# EAGLE design uC (EAGLE 8.2.1)
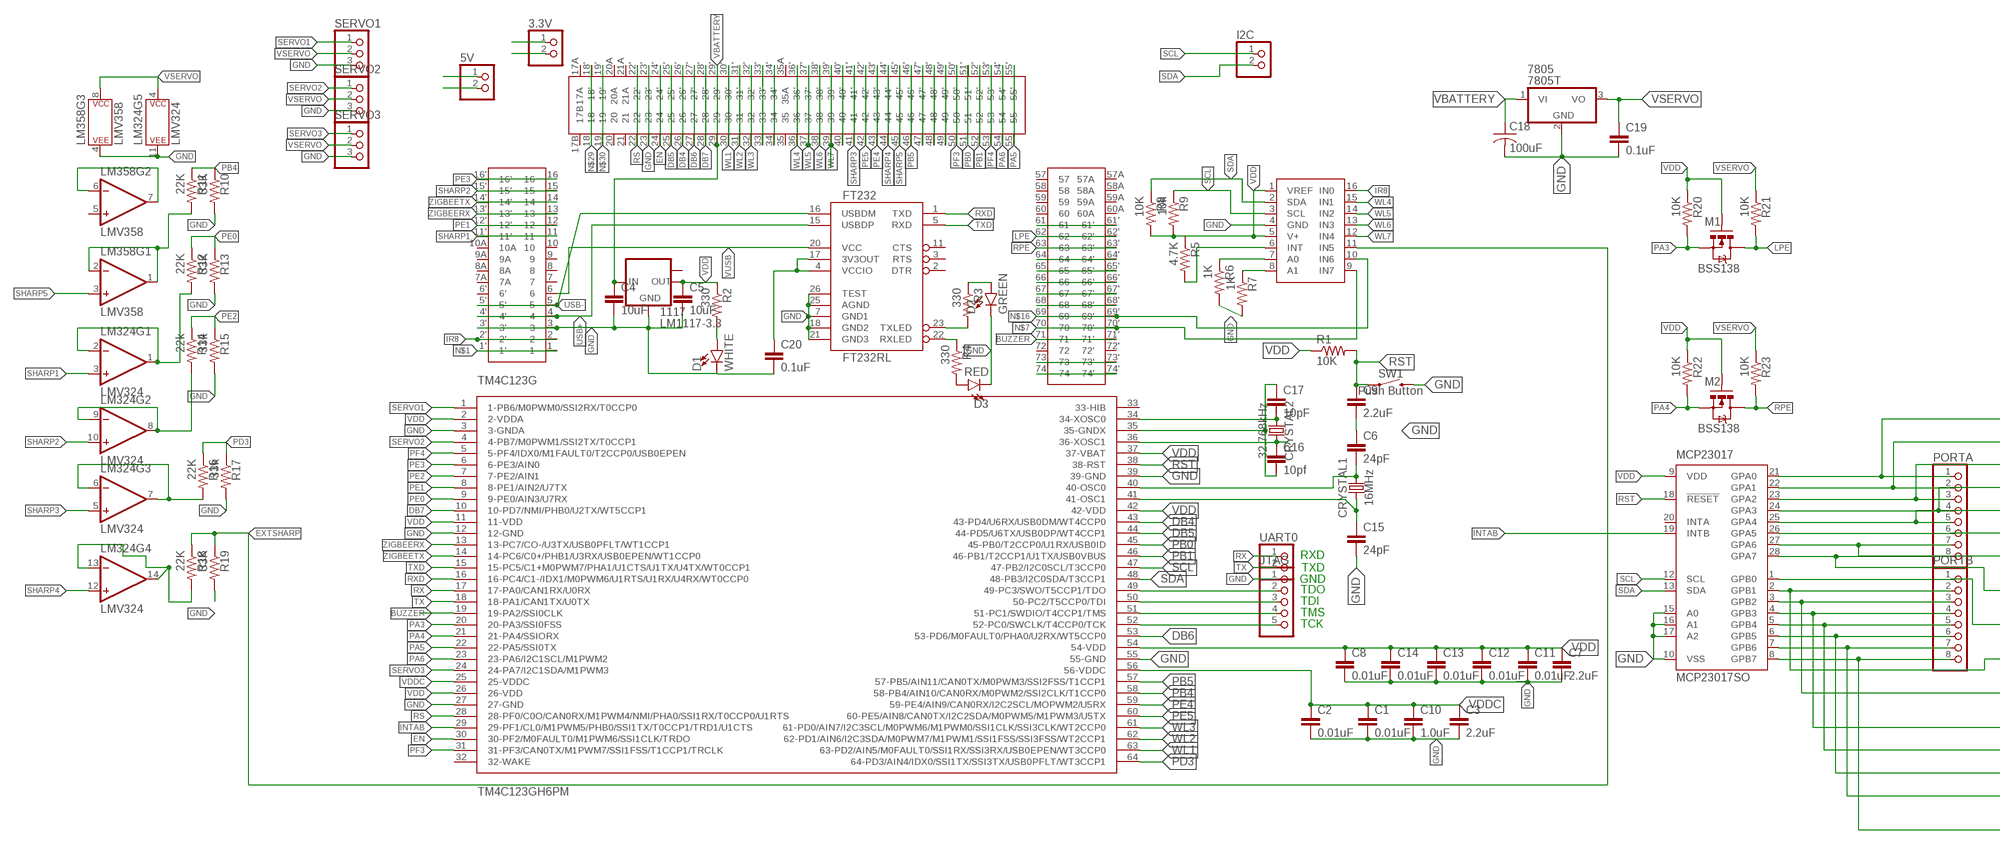
[diagram p0: schematic, sheet 1, part 1 of 2]
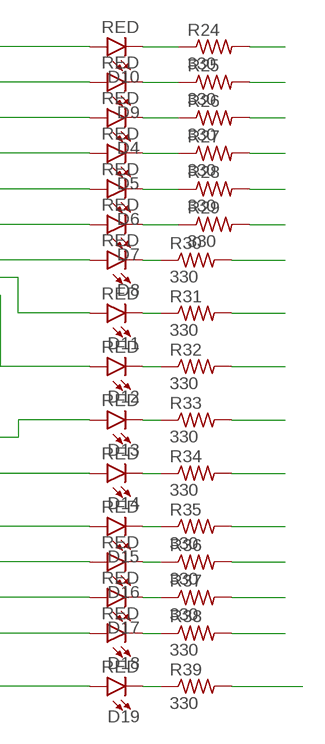
[diagram p1: schematic, sheet 1, part 2 of 2]

## Parts
3.3V  PINHD-1X2  [1X02]
5V  PINHD-1X2  [1X02]
1117  LM1117-3.3  LM1117IMPX-3.3  [SOT223]
7805  7805T  [TO220H]
ADC128D818  ADC128D818  [ADC12_SD]
C1  0.01uF  2.2UF-CERCAP-10009  [1206]
C2  0.01uF  2.2UF-CERCAP-10009  [1206]
C3  2.2uF  2.2UF-1206-50V-10%  [1206]
C4  10uF  10UF-1206-6.3V-20%  [1206]
C5  10uF  10UF-1206-6.3V-20%  [1206]
C6  24pF  2.2UF-CERCAP-10009  [1206]
C7  2.2uF  2.2UF-CERCAP-10009  [1206]
C8  0.01uF  2.2UF-CERCAP-10009  [1206]
C9  2.2uF  2.2UF-1206-50V-10%  [1206]
C10  1.0uF  1.0UF-1206-50V-10%  [1206]
C11  0.01uF  2.2UF-CERCAP-10009  [1206]
C12  0.01uF  2.2UF-CERCAP-10009  [1206]
C13  0.01uF  2.2UF-CERCAP-10009  [1206]
C14  0.01uF  2.2UF-CERCAP-10009  [1206]
C15  24pF  2.2UF-CERCAP-10009  [1206]
C16  10pf  2.2UF-CERCAP-10009  [1206]
C17  10pF  2.2UF-CERCAP-10009  [1206]
C18  100uF  C-US025-024X044  [C025-024X044]
C19  0.1uF  2.2UF-CERCAP-10009  [1206]
C20  0.1uF  10UF-1206-6.3V-20%  [1206]
CRYSTAL1  16MHz  CRYSTAL-16MHZPTH-HC49US  [HC49US]
CRYSTAL2  32.768kHz  CRYSTAL-32.768KHZPTH-2X6  [CRYSTAL-PTH-2X6-CYL]
D1  WHITE  LED-WHITE1206  [LED-1206]
D2  GREEN  LED-WHITE1206  [LED-1206]
D3  RED  LED-WHITE1206  [LED-1206]
D4  RED  LED-WHITE1206  [LED-1206]
D5  RED  LED-WHITE1206  [LED-1206]
D6  RED  LED-WHITE1206  [LED-1206]
D7  RED  LED-WHITE1206  [LED-1206]
D8  RED  LED-WHITE1206  [LED-1206]
D9  RED  LED-WHITE1206  [LED-1206]
D10  RED  LED-WHITE1206  [LED-1206]
D11  RED  LED-WHITE1206  [LED-1206]
D12  RED  LED-WHITE1206  [LED-1206]
D13  RED  LED-WHITE1206  [LED-1206]
D14  RED  LED-WHITE1206  [LED-1206]
D15  RED  LED-WHITE1206  [LED-1206]
D16  RED  LED-WHITE1206  [LED-1206]
D17  RED  LED-WHITE1206  [LED-1206]
D18  RED  LED-WHITE1206  [LED-1206]
D19  RED  LED-WHITE1206  [LED-1206]
FT232  FT232RL  FT232RL-BASICSSOP  [SSOP28DB]
I2C  PINHD-1X2  [1X02]
JTAG  PINHD-1X5_2.54  [1X05]
LM324  LMV324  [SO14]
LM358  LMV358  LMV358SOIC  [SO08]
M1  BSS138  MOSFET-NCHANNELSMD  [SOT23-3]
M2  BSS138  MOSFET-NCHANNELSMD  [SOT23-3]
MCP23017  MCP23017SO  [SO28W]
PORTA  PINHD-1X8BIG  [1X08-BIG]
PORTB  PINHD-1X8BIG  [1X08-BIG]
R1  10K  R-US_M1206  [M1206]
R2  330  R-US_M1206  [M1206]
R3  330  R-US_M1206  [M1206]
R4  330  R-US_M1206  [M1206]
R5  4.7K  R-US_M1206  [M1206]
R6  1K  R-US_M1206  [M1206]
R7  1K  R-US_M1206  [M1206]
R8  10K  R-US_M1206  [M1206]
R9  10k  R-US_M1206  [M1206]
R10  33K  R-US_M1206  [M1206]
R11  22K  R-US_M1206  [M1206]
R12  22K  R-US_M1206  [M1206]
R13  33K  R-US_M1206  [M1206]
R14  22k  R-US_M1206  [M1206]
R15  33k  R-US_M1206  [M1206]
R16  22K  R-US_M1206  [M1206]
R17  33k  R-US_M1206  [M1206]
R18  22K  R-US_M1206  [M1206]
R19  33K  R-US_M1206  [M1206]
R20  10K  RESISTOR1206  [1206]
R21  10K  RESISTOR1206  [1206]
R22  10K  RESISTOR1206  [1206]
R23  10K  RESISTOR1206  [1206]
R24  330  R-US_M1206  [M1206]
R25  330  R-US_M1206  [M1206]
R26  330  R-US_M1206  [M1206]
R27  330  R-US_M1206  [M1206]
R28  330  R-US_M1206  [M1206]
R29  330  R-US_M1206  [M1206]
R30  330  R-US_M1206  [M1206]
R31  330  R-US_M1206  [M1206]
R32  330  R-US_M1206  [M1206]
R33  330  R-US_M1206  [M1206]
R34  330  R-US_M1206  [M1206]
R35  330  R-US_M1206  [M1206]
R36  330  R-US_M1206  [M1206]
R37  330  R-US_M1206  [M1206]
R38  330  R-US_M1206  [M1206]
R39  330  R-US_M1206  [M1206]
SERVO1  PINHD-1X3  [1X03]
SERVO2  PINHD-1X3  [1X03]
SERVO3  PINHD-1X3  [1X03]
SW1  Push Button  MOMENTARY-SWITCH-SPST-PTH-6.0MM  [TACTILE_SWITCH_PTH_6.0MM]
TM4C123G  TM4C123GH6PM  TM4C123GH6PMS-PQFP-G64  [LQFP]
U$1  DAUGHTERBOARDDAUGHTERBOARD  [DAUGHTERBOARD]
UART0  PINHD-1X2  [1X02]

## Nets
BUZZER: TM4C123G.19(19-PA2/SSI0CLK) U$1.71 U$1.71'
DB4: TM4C123G.43(43-PD4/U6RX/USB0DM/WT4CCP0) U$1.26 U$1.26'
DB5: TM4C123G.44(44-PD5/U6TX/USB0DP/WT4CCP1) U$1.25 U$1.25'
DB6: TM4C123G.53(53-PD6/M0FAULT0/PHA0/U2RX/WT5CCP0) U$1.27 U$1.27'
DB7: TM4C123G.10(10-PD7/NMI/PHB0/U2TX/WT5CCP1) U$1.28 U$1.28'
EN: TM4C123G.30(30-PF2/M0FAULT0/M1PWM6/SSI1CLK/TRDO) U$1.24 U$1.24'
EXTSHARP: ADC128D818.11(IN5) R18.1 R19.1
FDSFSDF: LM324.1(OUT) LM324.2(-IN) R12.2
GND [VSERVO]: 3.3V.2 5V.2 1117.1(GND) 7805.2(GND) ADC128D818.4(GND) C1.2 C2.2 C3.2 C4.2 C5.2 C6.1 C7.2 C8.2 C9.2 C10.2 C11.2 C12.2 C13.2 C14.2 C15.2 C18.2 C19.2 C20.2 D1.C D2.C D3.C FT232.7(GND1) FT232.18(GND2) FT232.21(GND3) FT232.25(AGND) FT232.26(TEST) JTAG.1 LM324.11(P$V-) LM358.4(P$V-) MCP23017.10(VSS) MCP23017.15(A0) MCP23017.16(A1) MCP23017.17(A2) R6.2 R7.2 R10.2 R13.2 R15.2 R17.2 R19.2 R24.2 R25.2 R26.2 R27.2 R28.2 R29.2 R30.2 R31.2 R32.2 R33.2 R34.2 R35.2 R36.2 R37.2 R38.2 R39.2 SERVO1.3 SERVO2.3 SERVO3.3 SW1.3 TM4C123G.3(3-GNDA) TM4C123G.12(12-GND) TM4C123G.27(27-GND) TM4C123G.39(39-GND) TM4C123G.55(55-GND) U$1.3 U$1.3' U$1.23 U$1.23'
GNDX: C16.2 C17.1 TM4C123G.35(35-GNDX)
HGHJ: LM358.1(OUT) LM358.2(-IN) R11.2
INTAB: MCP23017.19(INTB) TM4C123G.29(29-PF1/CL0/M1PWM5/PHB0/SSI1TX/T0CCP1/TRD1/U1CTS)
IR8: ADC128D818.16(IN0) U$1.2 U$1.2'
LPE: M1.3(D) R21.2 U$1.62 U$1.62'
N$1: U$1.1 U$1.1'
N$2: D10.A MCP23017.21(GPA0) PORTA.1
N$3: C6.2 CRYSTAL1.2 TM4C123G.40(40-OSC0)
N$5: D9.A MCP23017.22(GPA1) PORTA.2
N$6: LM358.6(-IN) LM358.7(OUT)
N$7: ADC128D818.9(IN7) U$1.70 U$1.70'
N$8: D4.A MCP23017.23(GPA2) PORTA.3
N$9: D5.A MCP23017.24(GPA3) PORTA.4
N$10: D6.A MCP23017.25(GPA4) PORTA.5
N$11: JTAG.5 TM4C123G.52(52-PC0/SWCLK/T4CCP0/TCK)
N$12: U$1.74 U$1.74'
N$13: U$1.73 U$1.73'
N$14: LM324.13(-IN) LM324.14(OUT) R18.2
N$15: JTAG.4 TM4C123G.51(51-PC1/SWDIO/T4CCP1/TMS)
N$16: ADC128D818.10(IN6) D10.C R24.1 U$1.69 U$1.69'
N$17: U$1.68 U$1.68'
N$18: U$1.67 U$1.67'
N$19: U$1.66 U$1.66'
N$20: U$1.65 U$1.65'
N$21: U$1.64 U$1.64'
N$22: ADC128D818.7(A0) R6.1
N$23: D7.A MCP23017.26(GPA5) PORTA.6
N$24: U$1.61 U$1.61'
N$25: JTAG.3 TM4C123G.50(50-PC2/T5CCP0/TDI)
N$26: D1.A R2.2
N$27: C17.2 CRYSTAL2.1 TM4C123G.34(34-XOSC0)
N$28: C16.1 CRYSTAL2.2 TM4C123G.36(36-XOSC1)
N$29: D9.C R25.1 U$1.18 U$1.18'
N$30: D4.C R26.1 U$1.19 U$1.19'
N$31: JTAG.2 TM4C123G.49(49-PC3/SWO/T5CCP1/TDO)
N$32: D8.A MCP23017.27(GPA6) PORTA.7
N$33: D11.A MCP23017.28(GPA7) PORTA.8
N$34: D12.A MCP23017.1(GPB0) PORTB.1
N$35: D13.A MCP23017.2(GPB1) PORTB.2
N$36: D14.A MCP23017.3(GPB2) PORTB.3
N$37: D15.A MCP23017.4(GPB3) PORTB.4
N$38: D16.A MCP23017.5(GPB4) PORTB.5
N$39: D17.A MCP23017.6(GPB5) PORTB.6
N$40: D18.A MCP23017.7(GPB6) PORTB.7
N$41: D19.A MCP23017.8(GPB7) PORTB.8
N$42: U$1.33 U$1.33'
N$43: U$1.34 U$1.34'
N$44: D5.C R27.1
N$45: D6.C R28.1
N$46: D7.C R29.1
N$47: D8.C R30.1
N$48: U$1.40 U$1.40'
N$49: D11.C R31.1
N$50: D12.C R32.1
N$51: D13.C R33.1
N$52: D19.C R39.1
N$53: D18.C R38.1
N$54: D17.C R37.1
N$55: U$1.47 U$1.47'
N$56: U$1.48 U$1.48'
N$57: U$1.49 U$1.49'
N$58: D16.C R36.1
N$59: D15.C R35.1
N$60: D14.C R34.1
N$67: FT232.22(RXLED) R4.1
N$68: FT232.23(TXLED) R3.2
N$69: D3.A R4.2
N$70: D2.A R3.1
N$71: ADC128D818.6(INT) R5.2
N$73: ADC128D818.8(A1) R7.1
N$77: C20.1 FT232.4(VCCIO) FT232.17(3V3OUT)
NO: C15.1 CRYSTAL1.1 TM4C123G.41(41-OSC1)
PA3: M1.2(S) R20.2 TM4C123G.20(20-PA3/SSI0FSS)
PA4: M2.2(S) R22.2 TM4C123G.21(21-PA4/SSIORX)
PA5: TM4C123G.22(22-PA5/SSI0TX) U$1.55 U$1.55'
PA6: TM4C123G.23(23-PA6/I2C1SCL/M1PWM2) U$1.54 U$1.54'
PB0: TM4C123G.45(45-PB0/T2CCP0/U1RX/USB0ID) U$1.51 U$1.51'
PB1: TM4C123G.46(46-PB1/T2CCP1/U1TX/USB0VBUS) U$1.52 U$1.52'
PB4: R10.1 R11.1 TM4C123G.58(58-PB4/AIN10/CAN0RX/M0PWM2/SSI2CLK/T1CCP0)
PB5: TM4C123G.57(57-PB5/AIN11/CAN0TX/M0PWM3/SSI2FSS/T1CCP1) U$1.46 U$1.46'
PD3: R16.1 R17.1 TM4C123G.64(64-PD3/AIN4/IDX0/SSI1TX/SSI3TX/USB0PFLT/WT3CCP1)
PE0: R12.1 R13.1 TM4C123G.9(9-PE0/AIN3/U7RX)
PE1: TM4C123G.8(8-PE1/AIN2/U7TX) U$1.12 U$1.12'
PE2: R14.1 R15.1 TM4C123G.7(7-PE2/AIN1)
PE3: TM4C123G.6(6-PE3/AIN0) U$1.16 U$1.16'
PE4: TM4C123G.59(59-PE4/AIN9/CAN0RX/I2C2SCL/MOPWM2/U5RX) U$1.43 U$1.43'
PE5: TM4C123G.60(60-PE5/AIN8/CAN0TX/I2C2SDA/M0PWM5/M1PWM3/U5TX) U$1.42 U$1.42'
PF3: TM4C123G.31(31-PF3/CAN0TX/M1PWM7/SSI1FSS/T1CCP1/TRCLK) U$1.50 U$1.50'
PF4: TM4C123G.5(5-PF4/IDX0/M1FAULT0/T2CCP0/USB0EPEN) U$1.53 U$1.53'
RPE: M2.3(D) R23.2 U$1.63 U$1.63'
RS: TM4C123G.28(28-PF0/C0O/CAN0RX/M1PWM4/NMI/PHA0/SSI1RX/T0CCP0/U1RTS) U$1.22 U$1.22'
RST: C9.1 MCP23017.18(!RESET) R1.2 SW1.1 TM4C123G.38(38-RST)
RX: TM4C123G.17(17-PA0/CAN1RX/U0RX) UART0.1
RXD: FT232.1(TXD) TM4C123G.16(16-PC4/C1-/IDX1/M0PWM6/U1RTS/U1RX/U4RX/WT0CCP0)
SCL: ADC128D818.3(SCL) I2C.1 MCP23017.12(SCL) R9.1 TM4C123G.47(47-PB2/I2C0SCL/T3CCP0)
SDA: ADC128D818.2(SDA) I2C.2 MCP23017.13(SDA) R8.1 TM4C123G.48(48-PB3/I2C0SDA/T3CCP1)
SDFSDFSD: LM324.8(OUT) LM324.9(-IN) R14.2
SERVO1: SERVO1.1 TM4C123G.1(1-PB6/M0PWM0/SSI2RX/T0CCP0)
SERVO2: SERVO2.1 TM4C123G.4(4-PB7/M0PWM1/SSI2TX/T0CCP1)
SERVO3: SERVO3.1 TM4C123G.24(24-PA7/I2C1SDA/M1PWM3)
SHARP1: LM324.3(+IN) U$1.11 U$1.11'
SHARP2: LM324.10(+IN) U$1.15 U$1.15'
SHARP3: LM324.5(+IN) U$1.41 U$1.41'
SHARP4: LM324.12(+IN) U$1.44 U$1.44'
SHARP5: LM358.3(+IN) U$1.45 U$1.45'
TX: TM4C123G.18(18-PA1/CAN1TX/U0TX) UART0.2
TXD: FT232.5(RXD) TM4C123G.15(15-PC5/C1+M0PWM7/PHA1/U1CTS/U1TX/U4TX/WT0CCP1)
USB+: FT232.15(USBDP) U$1.4 U$1.4'
USB-: FT232.16(USBDM) U$1.5 U$1.5'
VBATTERY [VSERVO]: 1117.3(IN) 7805.1(VI) C4.1 C18.1 U$1.29 U$1.29'
VDD [VDD]: 3.3V.1 1117.2(OUT) ADC128D818.1(VREF) ADC128D818.5(V+) C5.1 C7.1 C8.1 C11.1 C12.1 C13.1 C14.1 M1.1(G) M2.1(G) MCP23017.9(VDD) R1.1 R2.1 R5.1 R8.2 R9.2 R20.1 R22.1 TM4C123G.2(2-VDDA) TM4C123G.11(11-VDD) TM4C123G.26(26-VDD) TM4C123G.37(37-VBAT) TM4C123G.42(42-VDD) TM4C123G.54(54-VDD)
VDDC: C1.1 C2.1 C3.1 C10.1 TM4C123G.25(25-VDDC) TM4C123G.56(56-VDDC)
VSERVO [VSERVO]: 5V.1 7805.3(VO) C19.1 LM324.4(P$V+) LM358.8(P$V+) R21.1 R23.1 SERVO1.2 SERVO2.2 SERVO3.2
VUSB: FT232.20(VCC) U$1.6
WL1: TM4C123G.63(63-PD2/AIN5/M0FAULT0/SSI1RX/SSI3RX/USB0EPEN/WT3CCP0) U$1.30 U$1.30'
WL2: TM4C123G.62(62-PD1/AIN6/I2C3SDA/M0PWM7/M1PWM1/SSI1FSS/SSI3FSS/WT2CCP1) U$1.31 U$1.31'
WL3: TM4C123G.61(61-PD0/AIN7/I2C3SCL/M0PWM6/M1PWM0/SSI1CLK/SSI3CLK/WT2CCP0) U$1.32 U$1.32'
WL4: ADC128D818.15(IN1) U$1.36 U$1.36'
WL5: ADC128D818.14(IN2) U$1.37 U$1.37'
WL6: ADC128D818.13(IN3) U$1.38 U$1.38'
WL7: ADC128D818.12(IN4) U$1.39 U$1.39'
XXVX: LM324.6(-IN) LM324.7(OUT) R16.2
ZIGBEERX: TM4C123G.13(13-PC7/CO-/U3TX/USB0PFLT/WT1CCP1) U$1.13 U$1.13'
ZIGBEETX: TM4C123G.14(14-PC6/C0+/PHB1/U3RX/USB0EPEN/WT1CCP0) U$1.14 U$1.14'
Unconnected: 1117.TAB(OUT1) FT232.2(DTR) FT232.3(RTS) FT232.11(CTS) LM358.5(+IN) MCP23017.20(INTA) TM4C123G.32(32-WAKE) TM4C123G.33(33-HIB) U$1.6' U$1.7 U$1.7A U$1.8 U$1.8A U$1.9 U$1.9A U$1.10 U$1.10A U$1.17A U$1.17B U$1.20 U$1.20A U$1.21 U$1.21A U$1.35 U$1.35A U$1.57 U$1.57A U$1.58 U$1.58A U$1.59 U$1.59A U$1.60 U$1.60A U$1.72 U$1.72'

## Notes on the sheet
- RXD
- TXD
- GND
- TDO
- TDI
- TMS
- TCK

## Library data of the parts
3.3V 5V I2C UART0 = pinhead:PINHD-1X2: PIN HEADER
1117 = lm1117:LM1117IMPX-*
7805 = adafruit:78*: Positive VOLTAGE REGULATOR Added bigger pads to the TO-92 package
ADC128D818 = ADC128D818:ADC128D818
C1 C2 C6 C8 C11-C17 C19 = SparkFun-Retired:2.2UF-CER: 2.2uF Ceramic SMT CAP-07888- 10V, 20% (0603) CAP-10009- 50V, 10% (1206); PROD_ID: CAP-10009; VALUE: 2.2uF
C3 C9 = SparkFun-Capacitors:2.2UF: 2.2µF ceramic capacitors A capacitor is a passive two-terminal electrical component used to store electrical energy temporarily in an electric field.; PROD_ID: CAP-10009
C4 C5 = SparkFun-Capacitors:10UF: 10.0µF ceramic capacitors A capacitor is a passive two-terminal electrical component used to store electrical energy temporarily in an electric field.; PROD_ID: CAP-10057
C7 = SparkFun-Retired:2.2UF-CER: 2.2uF Ceramic SMT CAP-07888- 10V, 20% (0603) CAP-10009- 50V, 10% (1206); PROD_ID: CAP-10009
C10 = SparkFun-Capacitors:1.0UF: 1µF ceramic capacitors A capacitor is a passive two-terminal electrical component used to store electrical energy temporarily in an electric field.; PROD_ID: CAP-09822
C18 = adafruit:C-US: CAPACITOR, American symbol
C20 = SparkFun-Capacitors:10UF: 10.0µF ceramic capacitors A capacitor is a passive two-terminal electrical component used to store electrical energy temporarily in an electric field.; PROD_ID: CAP-10057; VALUE: 10uF
CRYSTAL1 = SparkFun-Clocks:CRYSTAL-16MHZ: 16MHz Crystal Digikey Example <http://www.digikey.com/product-search/en?keywords=535-9122-1-ND> Frequency: 16MHz Frequency Stability: ±50ppm Frequency Tolerance: ±20ppm Load Capacitance: 18pF SparkFun Products: Pro Micro -5V/16MHz <https://www.sparkfun.com/products/12640> SparkFun Serial Enabled LCD Kit <https://www.sparkfun.com/products/10097>; PROD_ID: XTAL-08181; SF_ID: COM-00536
CRYSTAL2 = SparkFun-Clocks:CRYSTAL-32.768KHZ: 32.768kHz Crystal Frequency: 32.768kHz Frequency Stability: ±20ppm Load Capacitance: 12.5pF (PTH-2X6 & SMD-3.2X1.5), 6pF (SMD-2X6) SparkFun Products: SparkFun BigTime Watch Kit <https://www.sparkfun.com/products/11734> SparkFun nRF52832 Breakout <https://www.sparkfun.com/products/13990> SparkFun Real Time Clock Module <https://www.sparkfun.com/products/12708>; PROD_ID: XTAL-10112
D1 = SparkFun-LED:LED-WHITE: White SMD LED Used in manufacturing several products at SparkFun. Packages: 0603 - Bright White SMD 0603 package[Product Link] <http://www.kingbrightusa.com/product.asp?catalog_name=LED&product_id=APT1608QWF/D> 1206 - Bright White SMD1206 package [Product Link] <http://www.kingbrightusa.com/product.asp?catalog_name=LED&product_id=APT3216QWF/D> SparkFun Products: Blackberry Trackballer Breakout <https://www.sparkfun.com/products/13169> Digital SandBox <https://www.sparkfun.com/products/12651>; PROD_ID: DIO-09955
D2-D19 = SparkFun-LED:LED-WHITE: White SMD LED Used in manufacturing several products at SparkFun. Packages: 0603 - Bright White SMD 0603 package[Product Link] <http://www.kingbrightusa.com/product.asp?catalog_name=LED&product_id=APT1608QWF/D> 1206 - Bright White SMD1206 package [Product Link] <http://www.kingbrightusa.com/product.asp?catalog_name=LED&product_id=APT3216QWF/D> SparkFun Products: Blackberry Trackballer Breakout <https://www.sparkfun.com/products/13169> Digital SandBox <https://www.sparkfun.com/products/12651>; PROD_ID: DIO-09955; VALUE: WHITE
FT232 = SparkFun-IC-Comms:FT232RL-BASIC: FT232RL USB UART This is the simplified version of the FT232RL unit. Only what you need, nothing you don't. FT232RL 4th Generation USB UART (USB <-> Serial) Controller. Datasheet <http://www.sparkfun.com/datasheets/IC/FT232R_v104.pdf> SparkFun Products Component <https://www.sparkfun.com/products/650> (COM-00650) SparkFun RedBot Mainboard <https://www.sparkfun.com/products/12097> (ROB-12097) SparkFun FTDI Basic Breakout - 5V <https://www.sparkfun.com/products/9716> (DEV-09716) SparkFun FTDI Basic Breakout - 3.3V <https://www.sparkfun.com/products/9873> (DEV-09873) Bus Pirate - v3.6a <https://www.sparkfun.com/products/12942> (TOL-12942) SparkFun USB to Serial Breakout - FT232RL <https://www.sparkfun.com/products/12731> (BOB-12731) SparkFun PicoBoard <https://www.sparkfun.com/products/11888> (WIG-11888) SparkFun RFID USB Reader <https://www.sparkfun.com/products/9963> (SEN-09963) LilyPad FTDI Basic Breakout - 5V <https://www.sparkfun.com/products/10275> (DEV-10275) SparkFun Stepoko <https://www.sparkfun.com/products/13899> (ROB-13899); PROD_ID: IC-00870
JTAG = pinhead-fixdrills:PINHD-1X5: PIN HEADER
LM324 = SparkFun-IC-Amplifiers:LMV324: IC LMV324 Quad Op Amp Jellybean quad op-amp Datasheet <http://cdn.sparkfun.com/datasheets/Sensors/Sound/LMV324.pdf> SparkFun Products SparkFun Sensor Kit <https://www.sparkfun.com/products/13754> (DEV-13754) SparkFun Inventor's Kit for Arduino 101 <https://www.sparkfun.com/products/13844> (KIT-13844) SparkFun Sound Detector <https://www.sparkfun.com/products/12642> (SEN-12642); PROD_ID: IC-08227
LM358 = SparkFun-IC-Amplifiers:LMV358: IC LMV358 DUAL OP AMP Jellybean rail-to-rail output op-amp SparkFun Products SparkFun PicoBoard <https://www.sparkfun.com/products/11888> (WIG-11888) SparkFun Vernier Interface Shield <https://www.sparkfun.com/products/12858> (DEV-12858) SparkFun Blynk Board - ESP8266 <https://www.sparkfun.com/products/13794> (WRL-13794) SparkFun Digital Sandbox <https://www.sparkfun.com/products/12651> (DEV-12651 RoHS); PROD_ID: IC-09657
M1 M2 = SparkFun:MOSFET-NCHANNEL
MCP23017 = adafruit:MCP23017: http://ww1.microchip.com/downloads/en/DeviceDoc/21952a.pdf Source: http://ww1.microchip.com/downloads/en/DeviceDoc/21952a.pdf
PORTA PORTB = adafruit:PINHD-1X8: PIN HEADER
R1-R19 R24-R39 = adafruit:R-US_: RESISTOR, American symbol
R20-R23 = SparkFun:RESISTOR: Resistor Basic schematic elements and footprints for 0603, 1206, and PTH resistors.
SERVO1-SERVO3 = adafruit:PINHD-1X3: PIN HEADER
SW1 = SparkFun-Switches:MOMENTARY-SWITCH-SPST: Momentary Switch (Pushbutton) - SPST Normally-open (NO) SPST momentary switches (buttons, pushbuttons). Variants PTH-12MM - 12mm square, through-hole Momentary Pushbutton Switch - 12mm Square <https://www.sparkfun.com/products/9190> (COM-09190) PTH-6.0MM, PTH-6.0MM-KIT - 6.0mm square, through-hole Mini Pushbutton Switch <https://www.sparkfun.com/products/97> (COM-00097) KIT package intended for soldering kit's - only one side of pads' copper is exposed. PTH-RIGHT-ANGLE-KIT - Right-angle, through-hole Right Angle Tactile Button <https://www.sparkfun.com/products/10791> - Used on SparkFun BigTime Watch Kit <https://www.sparkfun.com/products/11734> SMD-12MM - 12mm square, surface-mount Tactile Button - SMD (12mm) <https://www.sparkfun.com/products/12993> (COM-12993) Used on SparkFun PicoBoard <https://www.sparkfun.com/products/11888> SMD-4.5MM - 4.5mm Square Trackball Switch Used on SparkFun Blackberry Trackballer Breakout <https://www.sparkfun.com/products/13169> SMD-4.6MMX2.8MM - 4.60mm x 2.80mm, surface mount Used on SparkFun SAMD21 Mini Breakout <https://www.sparkfun.com/products/13664> SMD-5.2MM, SMD-5.2-REDUNDANT - 5.2mm square, surface-mount Mini Pushbutton Switch - SMD <https://www.sparkfun.com/products/8720> (COM-08720) Used on Arduino Pro Mini <https://www.sparkfun.com/products/11114> REDUNDANT package connects both switch circuits together SMD-6.0X3.5MM - 6.0 x 3.5mm, surface mount Momentary Reset Switch SMD <https://www.sparkfun.com/products/8229> (COM-08229) SMD-6.2MM-TALL - 6.2mm square, surface mount Tactile Button - SMD (6mm) <https://www.sparkfun.com/products/12992> Used on SparkFun Digital Sandbox <https://www.sparkfun.com/products/12651> SMD-RIGHT-ANGLE - Right-angle, surface mount Used on SparkFun Block for Intel® Edison - Arduino <https://www.sparkfun.com/products/13036>; PROD_ID: SWCH-08441; SF_SKU: COM-00097
TM4C123G = TM4C123GH6PM:TM4C123GH6PM
U$1 = Daughterboard:DAUGHTERBOARD

## Net classes
1 VSERVO: width 0.8 mm, clearance 0.2 mm
2 VDD: width 0.5 mm, clearance 0.2 mm

## Board
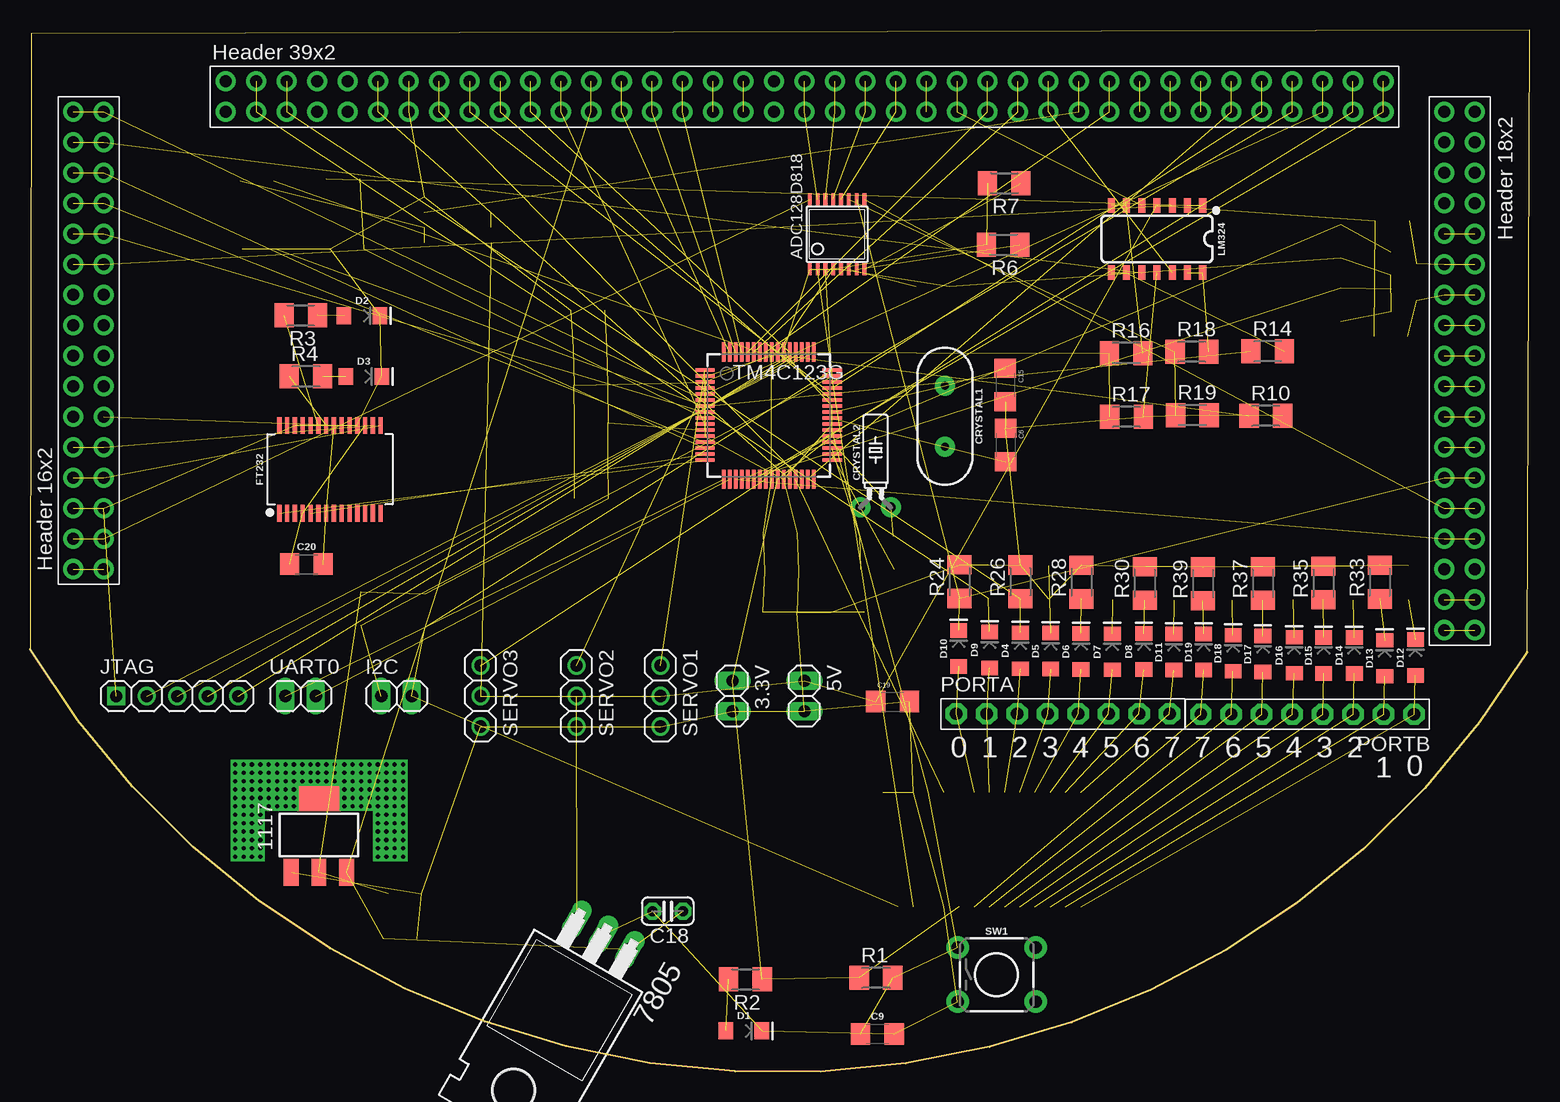
[diagram p2: board, top side]
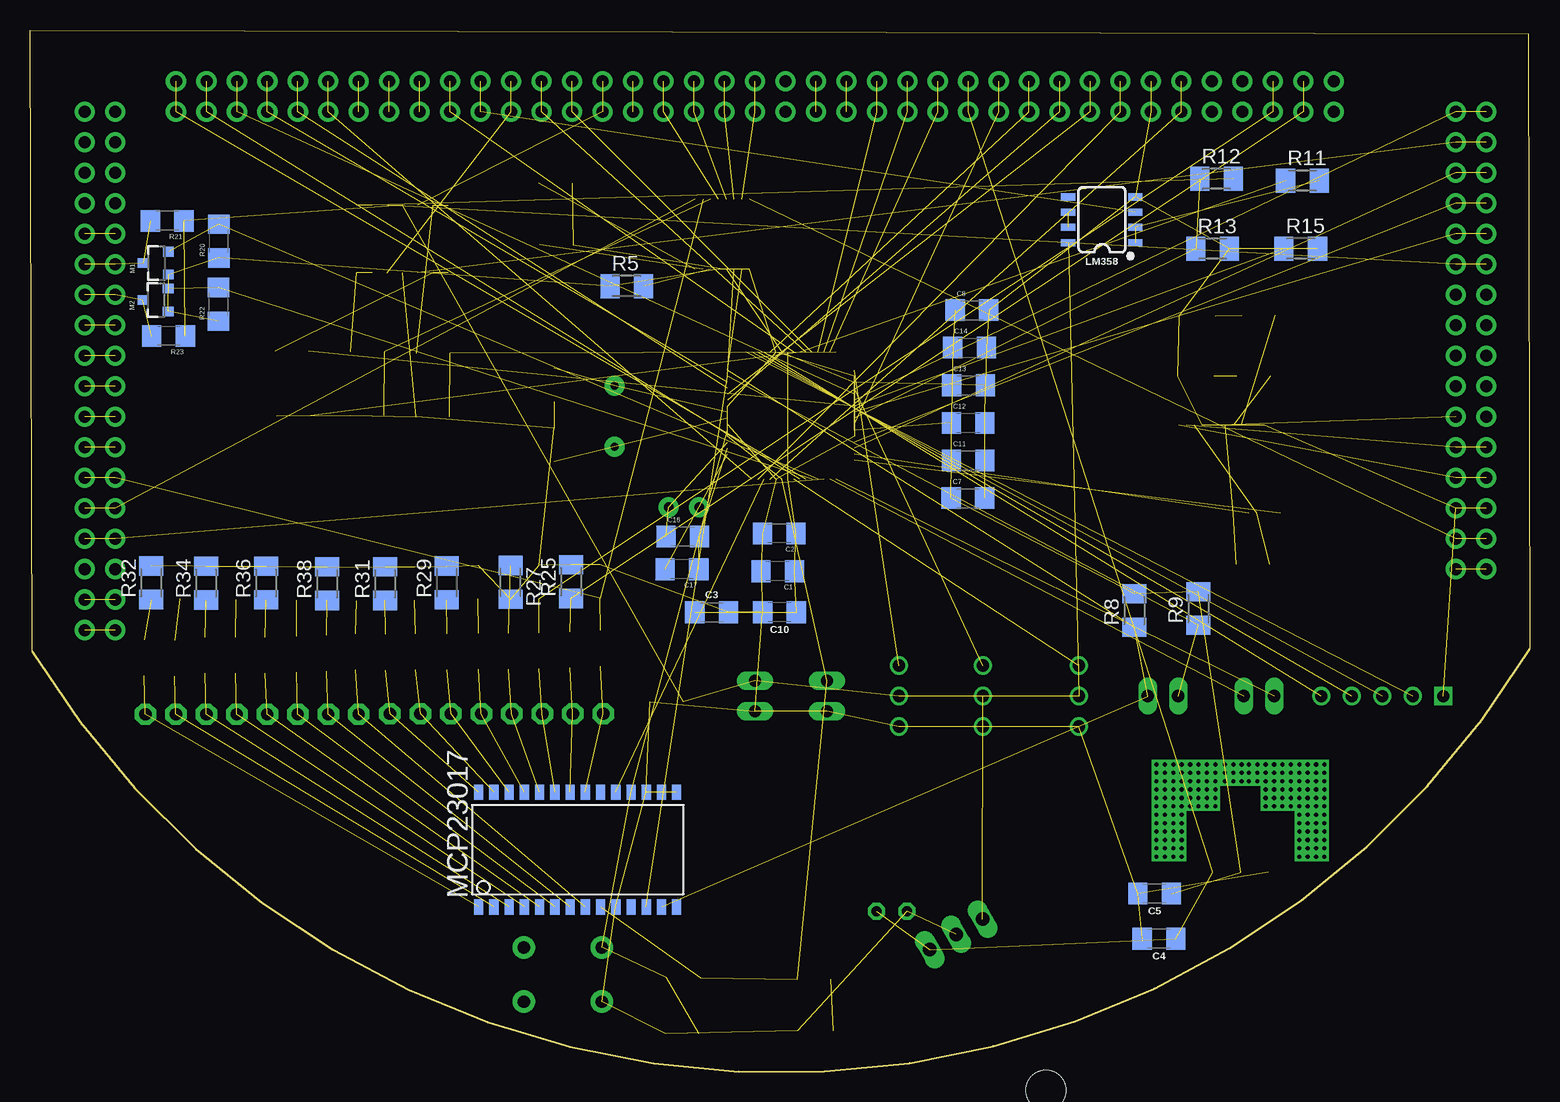
[diagram p3: board, bottom side, seen from below]

Size 125 x 86.8 mm. Coordinates in mm from the lower left corner, seen from the top.
Outline: 124.8,35 125,86.8 0.1,86.5 0,35.2 arc118 124.8,35
Copper layers (1*16): Top 0.035mm / dielectric 1.5mm / Bottom 0.035mm
Design rules "default *": minimum track width 6mil, minimum drill 0.35mm, track to track 0.2mm, track to pad 0.2mm, pad to pad 0.2mm, via to via 0.2mm, smd to smd 0.2mm, copper to edge 40mil, drill to drill 6mil, minimum pad ring 10mil, minimum via ring 8mil, stop-mask expansion 4mil, vias tented up to drill 0mil, thermal gap 10mil

### Footprints (pad centres in the part's own frame; a part is rotated, then mirrored left to right if it is on the bottom)
1X02 = drill 1.016 long: 1 -1.27,0; 2 1.27,0
SOT223 = smd 1.219 x 2.235: 1 -2.311,-3.099; 2 0,-3.099; 3 2.311,-3.099 | smd 3.6 x 2.2: TAB 0,3.099
TO220H = drill 1.118 long: 1 -2.54,-10.16; 2 0,-10.16; 3 2.54,-10.16 | hole 3.302: 0,4.826
ADC12_SD = smd 0.305 x 0.991: 1 -2.275,-2.918; 2 -1.625,-2.918; 3 -0.975,-2.918; 4 -0.325,-2.918; 5 0.325,-2.918; 6 0.975,-2.918; 7 1.625,-2.918; 8 2.275,-2.918; 9 2.275,2.918; 10 1.625,2.918; 11 0.975,2.918; 12 0.325,2.918; 13 -0.325,2.918; 14 -0.975,2.918; 15 -1.625,2.918; 16 -2.275,2.918
1206 = smd 1.6 x 1.8: 1 -1.4,0; 2 1.4,0
C025-024X044 = drill 0.813 pad 1.422 octagon: 1 -1.27,0; 2 1.27,0
HC49US = drill 0.7 pad 1.651: 1 -2.54,0; 2 2.54,0
CRYSTAL-PTH-2X6-CYL = drill 0.813 pad 1.676: 1 -1.27,0; 2 1.27,0
LED-1206 = smd 1.2 x 1.4: A -1.5,0; C 1.5,0
SSOP28DB = smd 0.348 x 1.397: 1 -4.225,-3.656; 2 -3.575,-3.656; 3 -2.925,-3.656; 4 -2.275,-3.656; 5 -1.625,-3.656; 6 -0.975,-3.656; 7 -0.325,-3.656; 8 0.325,-3.656; 9 0.975,-3.656; 10 1.625,-3.656; 11 2.275,-3.656; 12 2.925,-3.656; 13 3.575,-3.656; 14 4.225,-3.656; 15 4.225,3.656; 16 3.575,3.656; 17 2.925,3.656; 18 2.275,3.656; 19 1.625,3.656; 20 0.975,3.656; 21 0.325,3.656; 22 -0.325,3.656; 23 -0.975,3.656; 24 -1.625,3.656; 25 -2.275,3.656; 26 -2.925,3.656; 27 -3.575,3.656; 28 -4.225,3.656
1X05 = drill 1 square: 1 -5.08,0 | drill 1: 2 -2.54,0; 3 0,0; 4 2.54,0; 5 5.08,0
SO14 = smd 0.6 x 1.2: 1 -3.175,-2.8; 2 -1.905,-2.8; 3 -0.635,-2.8; 4 0.635,-2.8; 5 1.905,-2.8; 6 3.175,-2.8; 7 4.445,-2.8; 8 4.445,2.8; 9 3.175,2.8; 10 1.905,2.8; 11 0.635,2.8; 12 -0.635,2.8; 13 -1.905,2.8; 14 -3.175,2.8
SO08 = smd 0.6 x 1.2: 1 -1.905,-2.8; 2 -0.635,-2.8; 3 0.635,-2.8; 4 1.905,-2.8; 5 1.905,2.8; 6 0.635,2.8; 7 -0.635,2.8; 8 -1.905,2.8
SOT23-3 = smd 0.8 x 0.9: 1 -0.95,-1; 2 0.95,-1; 3 0,1.1
SO28W = smd 0.762 x 1.27: 1 -7.62,-4.78; 2 -6.35,-4.78; 3 -5.08,-4.78; 4 -3.81,-4.78; 5 -2.54,-4.78; 6 -1.27,-4.78; 7 0,-4.78; 8 1.27,-4.78; 9 2.54,-4.78; 10 3.81,-4.78; 11 5.08,-4.78; 12 6.35,-4.78; 13 7.62,-4.78; 14 8.89,-4.78; 15 8.89,4.78; 16 7.62,4.78; 17 6.35,4.78; 18 5.08,4.78; 19 3.81,4.78; 20 2.54,4.78; 21 1.27,4.78; 22 0,4.78; 23 -1.27,4.78; 24 -2.54,4.78; 25 -3.81,4.78; 26 -5.08,4.78; 27 -6.35,4.78; 28 -7.62,4.78
1X08-BIG = drill 1.016 pad 1.778 octagon: 1 -8.89,0; 2 -6.35,0; 3 -3.81,0; 4 -1.27,0; 5 1.27,0; 6 3.81,0; 7 6.35,0; 8 8.89,0
M1206 = smd 1.6 x 2: 1 -1.4,0; 2 1.4,0
1X03 = drill 1.016: 1 -2.54,0; 2 0,0; 3 2.54,0
TACTILE_SWITCH_PTH_6.0MM = drill 1.016 pad 1.88: 1 -3.251,2.261; 2 3.251,2.261; 3 -3.251,-2.261; 4 3.251,-2.261
LQFP = smd 1.6 x 0.3: 1 -5.3,3.8; 2 -5.3,3.3; 3 -5.3,2.8; 4 -5.3,2.3; 5 -5.3,1.8; 6 -5.3,1.3; 7 -5.3,0.8; 8 -5.3,0.3; 9 -5.3,-0.2; 10 -5.3,-0.7; 11 -5.3,-1.2; 12 -5.3,-1.7; 13 -5.3,-2.2; 14 -5.3,-2.7; 15 -5.3,-3.2; 16 -5.3,-3.7; 33 5.3,-3.7; 34 5.3,-3.2; 35 5.3,-2.7; 36 5.3,-2.2; 37 5.3,-1.7; 38 5.3,-1.2; 39 5.3,-0.7; 40 5.3,-0.2; 41 5.3,0.3; 42 5.3,0.8; 43 5.3,1.3; 44 5.3,1.8; 45 5.3,2.3; 46 5.3,2.8; 47 5.3,3.3; 48 5.3,3.8 | smd 0.3 x 1.6: 17 -3.75,-5.3; 18 -3.25,-5.3; 19 -2.75,-5.3; 20 -2.25,-5.3; 21 -1.75,-5.3; 22 -1.25,-5.3; 23 -0.75,-5.3; 24 -0.25,-5.3; 25 0.25,-5.3; 26 0.75,-5.3; 27 1.25,-5.3; 28 1.75,-5.3; 29 2.25,-5.3; 30 2.75,-5.3; 31 3.25,-5.3; 32 3.75,-5.3; 49 3.75,5.3; 50 3.25,5.3; 51 2.75,5.3; 52 2.25,5.3; 53 1.75,5.3; 54 1.25,5.3; 55 0.75,5.3; 56 0.25,5.3; 57 -0.25,5.3; 58 -0.75,5.3; 59 -1.25,5.3; 60 -1.75,5.3; 61 -2.25,5.3; 62 -2.75,5.3; 63 -3.25,5.3; 64 -3.75,5.3
DAUGHTERBOARD = drill 1 pad 1.676: 1 -22.86,-22.86; 1' -25.4,-22.86; 2 -22.86,-20.32; 2' -25.4,-20.32; 3 -22.86,-17.78; 3' -25.4,-17.78; 4 -22.86,-15.24; 4' -25.4,-15.24; 5 -22.86,-12.7; 5' -25.4,-12.7; 6 -22.86,-10.16; 6' -25.4,-10.16; 7 -22.86,-7.62; 7A -25.4,-7.62; 8 -22.86,-5.08; 8A -25.4,-5.08; 9 -22.86,-2.54; 9A -25.4,-2.54; 10 -22.86,0; 10A -25.4,0; 11 -22.86,2.54; 11' -25.4,2.54; 12 -22.86,5.08; 12' -25.4,5.08; 13 -22.86,7.62; 13' -25.4,7.62; 14 -22.86,10.16; 14' -25.4,10.16; 15 -22.86,12.7; 15' -25.4,12.7; 16 -22.86,15.24; 16' -25.4,15.24; 17A -12.7,17.78; 17B -12.7,15.24; 18 -10.16,15.24; 18' -10.16,17.78; 19 -7.62,15.24; 19' -7.62,17.78; 20 -5.08,15.24; 20A -5.08,17.78; 21 -2.54,15.24; 21A -2.54,17.78; 22 0,15.24; 22' 0,17.78; 23 2.54,15.24; 23' 2.54,17.78; 24 5.08,15.24; 24' 5.08,17.78; 25 7.62,15.24; 25' 7.62,17.78; 26 10.16,15.24; 26' 10.16,17.78; 27 12.7,15.24; 27' 12.7,17.78; 28 15.24,15.24; 28' 15.24,17.78; 29 17.78,15.24; 29' 17.78,17.78; 30 20.32,15.24; 30' 20.32,17.78; 31 22.86,15.24; 31' 22.86,17.78; 32 25.4,15.24; 32' 25.4,17.78; 33 27.94,15.24; 33' 27.94,17.78; 34 30.48,15.24; 34' 30.48,17.78; 35 33.02,15.24; 35A 33.02,17.78; 36 35.56,15.24; 36' 35.56,17.78; 37 38.1,15.24; 37' 38.1,17.78; 38 40.64,15.24; 38' 40.64,17.78; 39 43.18,15.24; 39' 43.18,17.78; 40 45.72,15.24; 40' 45.72,17.78; 41 48.26,15.24; 41' 48.26,17.78; 42 50.8,15.24; 42' 50.8,17.78; 43 53.34,15.24; 43' 53.34,17.78; 44 55.88,15.24; 44' 55.88,17.78; 45 58.42,15.24; 45' 58.42,17.78; 46 60.96,15.24; 46' 60.96,17.78; 47 63.5,15.24; 47' 63.5,17.78; 48 66.04,15.24; 48' 66.04,17.78; 49 68.58,15.24; 49' 68.58,17.78; 50 71.12,15.24; 50' 71.12,17.78; 51 73.66,15.24; 51' 73.66,17.78; 52 76.2,15.24; 52' 76.2,17.78; 53 78.74,15.24; 53' 78.74,17.78; 54 81.28,15.24; 54' 81.28,17.78; 55 83.82,15.24; 55' 83.82,17.78; 57 88.9,15.24; 57A 91.44,15.24; 58 88.9,12.7; 58A 91.44,12.7; 59 88.9,10.16; 59A 91.44,10.16; 60 88.9,7.62; 60A 91.44,7.62; 61 88.9,5.08; 61' 91.44,5.08; 62 88.9,2.54; 62' 91.44,2.54; 63 88.9,0; 63' 91.44,0; 64 88.9,-2.54; 64' 91.44,-2.54; 65 88.9,-5.08; 65' 91.44,-5.08; 66 88.9,-7.62; 66' 91.44,-7.62; 67 88.9,-10.16; 67' 91.44,-10.16; 68 88.9,-12.7; 68' 91.44,-12.7; 69 88.9,-15.24; 69' 91.44,-15.24; 70 88.9,-17.78; 70' 91.44,-17.78; 71 88.9,-20.32; 71' 91.44,-20.32; 72 88.9,-22.86; 72' 91.44,-22.86; 73 88.9,-25.4; 73' 91.44,-25.4; 74 88.9,-27.94; 74' 91.44,-27.94

### Placement (x,y rotation side)
3.3V  58.56,31.3 270 top
5V  64.56,31.3 270 top
1117  24.08,19.71 0 top
7805  42.72,2.64 150 top
ADC128D818  67.28,69.78 0 top
C1  62.67,41.7 180 bottom
C2  62.54,44.85 180 bottom
C3  68.18,38.29 0 bottom
C4  30.89,11.07 180 bottom
C5  31.25,14.83 180 bottom
C6  81.32,52.22 270 top
C7  46.81,47.79 0 bottom
C8  46.48,63.45 0 bottom
C9  70.64,3.15 0 top
C10  62.52,38.28 180 bottom
C11  46.79,50.94 0 bottom
C12  46.79,54.07 0 bottom
C13  46.77,57.2 0 bottom
C14  46.68,60.34 0 bottom
C15  81.29,57.23 270 top
C16  70.59,44.61 0 bottom
C17  70.65,41.87 180 bottom
C18  53.16,13.37 180 top
C19  71.9,30.84 0 top
C20  23.05,42.29 0 top
CRYSTAL1  76.27,54.61 270 top
CRYSTAL2  70.49,47.02 0 top
D1  59.51,3.4 0 top
D2  27.68,62.99 0 top
D3  27.83,57.93 0 top
D4  82.56,35.08 90 top
D5  85.09,35.05 90 top
D6  87.61,35.02 90 top
D7  90.22,34.99 90 top
D8  92.86,35.01 90 top
D9  79.99,35.15 90 top
D10  77.42,35.26 90 top
D11  95.36,34.96 90 top
D12  115.49,34.5 90 top
D13  112.93,34.45 90 top
D14  110.39,34.69 90 top
D15  107.83,34.69 90 top
D16  105.39,34.7 90 top
D17  102.77,34.79 90 top
D18  100.29,34.86 90 top
D19  97.83,34.97 90 top
FT232  25.01,50.19 0 top
I2C  30.56,31.3 0 top
JTAG  12.26,31.3 0 top
LM324  94.58,69.38 180 top
LM358  35.65,70.99 90 bottom
M1  114.45,67.37 90 bottom
M2  114.48,64.29 90 bottom
MCP23017  79.98,18.5 0 bottom
PORTA  86.11,29.82 0 top
PORTB  106.49,29.78 180 top
R1  70.52,7.82 0 top
R2  59.64,7.69 180 top
R3  22.59,63.02 180 top
R4  23,57.93 0 top
R5  75.26,65.47 0 bottom
R6  81.13,68.91 180 top
R7  81.21,74.05 180 top
R8  32.95,38.42 90 bottom
R9  27.61,38.59 90 bottom
R10  103.02,54.65 0 top
R11  18.93,74.26 0 bottom
R12  26.09,74.4 0 bottom
R13  26.42,68.57 0 bottom
R14  103.17,60.03 0 top
R15  19.07,68.59 0 bottom
R16  91.38,59.88 0 top
R17  91.41,54.56 0 top
R18  96.85,59.98 0 top
R19  96.9,54.71 0 top
R20  109.25,69.21 90 bottom
R21  113.57,70.9 180 bottom
R22  109.28,63.94 90 bottom
R23  113.44,61.3 180 bottom
R24  77.49,40.83 90 top
R25  79.9,40.83 90 bottom
R26  82.55,40.82 90 top
R27  84.95,40.77 270 bottom
R28  87.66,40.79 90 top
R29  90.26,40.73 90 bottom
R30  92.92,40.68 90 top
R31  95.41,40.67 90 bottom
R32  114.89,40.74 90 bottom
R33  112.51,40.79 90 top
R34  110.32,40.7 90 bottom
R35  107.81,40.71 90 top
R36  105.33,40.72 90 bottom
R37  102.77,40.68 90 top
R38  100.24,40.66 90 bottom
R39  97.78,40.65 90 top
SERVO1  52.56,31.3 270 top
SERVO2  45.56,31.3 270 top
SERVO3  37.56,31.3 270 top
SW1  80.58,8.09 0 top
TM4C123G  61.57,54.66 0 top
U$1  29.01,64.74 0 top
UART0  22.56,31.3 0 top

### Tracks (layer width: path | path; a pad name or v marks a point on that pad's centre or on a via)
BUZZER  (2 unrouted)
DB4  (2 unrouted)
DB5  (2 unrouted)
DB6  (2 unrouted)
DB7  (2 unrouted)
EN  (2 unrouted)
EXTSHARP  (2 unrouted)
FDSFSDF  (2 unrouted)
GND  (73 unrouted)
GNDX  (2 unrouted)
HGHJ  (2 unrouted)
INTAB  (1 unrouted)
IR8  (2 unrouted)
LPE  (3 unrouted)
N$1  (1 unrouted)
N$2  (2 unrouted)
N$3  (2 unrouted)
N$4  (via drill 0.35)
  other vias: 26.9,23.5
N$5  (2 unrouted)
N$6  (1 unrouted)
N$7  (2 unrouted)
N$8  (2 unrouted)
N$9  (2 unrouted)
N$10  (2 unrouted)
N$11  (1 unrouted)
N$12  (1 unrouted)
N$13  (1 unrouted)
N$14  (2 unrouted)
N$15  (1 unrouted)
N$16  (4 unrouted)
N$17  (1 unrouted)
N$18  (1 unrouted)
N$19  (1 unrouted)
N$20  (1 unrouted)
N$21  (1 unrouted)
N$22  (1 unrouted)
N$23  (2 unrouted)
N$24  (1 unrouted)
N$25  (1 unrouted)
N$26  (1 unrouted)
N$27  (2 unrouted)
N$28  (2 unrouted)
N$29  (3 unrouted)
N$30  (3 unrouted)
N$31  (1 unrouted)
N$32  (2 unrouted)
N$33  (2 unrouted)
N$34  (2 unrouted)
N$35  (2 unrouted)
N$36  (2 unrouted)
N$37  (2 unrouted)
N$38  (2 unrouted)
N$39  (2 unrouted)
N$40  (2 unrouted)
N$41  (2 unrouted)
N$42  (1 unrouted)
N$43  (1 unrouted)
N$44  (1 unrouted)
N$45  (1 unrouted)
N$46  (1 unrouted)
N$47  (1 unrouted)
N$48  (1 unrouted)
N$49  (1 unrouted)
N$50  (1 unrouted)
N$51  (1 unrouted)
N$52  (1 unrouted)
N$53  (1 unrouted)
N$54  (1 unrouted)
N$55  (1 unrouted)
N$56  (1 unrouted)
N$57  (1 unrouted)
N$58  (1 unrouted)
N$59  (1 unrouted)
N$60  (1 unrouted)
N$61  (via drill 0.35)
  other vias: 26.9,22.8
N$62  (via drill 0.35)
  other vias: 26.9,22.1
N$63  (via drill 0.35)
  other vias: 26.2,22.1
N$64  (via drill 0.35)
  other vias: 26.2,22.8
N$65  (via drill 0.35)
  other vias: 26.2,23.5
N$66  (via drill 0.35)
  other vias: 22,23.5
N$67  (1 unrouted)
N$68  (1 unrouted)
N$69  (1 unrouted)
N$70  (1 unrouted)
N$71  (1 unrouted)
N$72  (via drill 0.35)
  other vias: 22,22.8
N$73  (1 unrouted)
N$74  (via drill 0.35)
  other vias: 22,22.1
N$75  (via drill 0.35)
  other vias: 21.3,22.1
N$76  (via drill 0.35)
  other vias: 21.3,22.8
N$77  (2 unrouted)
N$78  (via drill 0.35)
  other vias: 21.3,23.5
N$79  (via drill 0.35)
  other vias: 22,25.6
N$80  (via drill 0.35)
  other vias: 22,24.9
N$81  (via drill 0.35)
  other vias: 22,24.2
N$82  (via drill 0.35)
  other vias: 21.3,24.2
N$83  (via drill 0.35)
  other vias: 21.3,24.9
N$84  (via drill 0.35)
  other vias: 21.3,25.6
N$85  (via drill 0.35)
  other vias: 26.9,25.6
N$86  (via drill 0.35)
  other vias: 26.9,24.9
N$87  (via drill 0.35)
  other vias: 26.9,24.2
N$88  (via drill 0.35)
  other vias: 26.2,24.2
N$89  (via drill 0.35)
  other vias: 26.2,24.9
N$90  (via drill 0.35)
  other vias: 26.2,25.6
N$91  (via drill 0.35)
  other vias: 23.4,25.6
N$92  (via drill 0.35)
  other vias: 23.4,24.9
N$93  (via drill 0.35)
  other vias: 23.4,24.2
N$94  (via drill 0.35)
  other vias: 22.7,24.2
N$95  (via drill 0.35)
  other vias: 22.7,24.9
N$96  (via drill 0.35)
  other vias: 22.7,25.6
N$97  (via drill 0.35)
  other vias: 24.7,25.6
N$98  (via drill 0.35)
  other vias: 24.7,24.9
N$99  (via drill 0.35)
  other vias: 24.7,24.2
N$100  (via drill 0.35)
  other vias: 24,24.2
N$101  (via drill 0.35)
  other vias: 24,24.9
N$102  (via drill 0.35)
  other vias: 24,25.6
N$103  (via drill 0.35)
  other vias: 20.6,23.5
N$104  (via drill 0.35)
  other vias: 20.6,22.8
N$105  (via drill 0.35)
  other vias: 20.6,22.1
N$106  (via drill 0.35)
  other vias: 19.9,22.1
N$107  (via drill 0.35)
  other vias: 19.9,22.8
N$108  (via drill 0.35)
  other vias: 19.9,23.5
N$109  (via drill 0.35)
  other vias: 20.6,25.6
N$110  (via drill 0.35)
  other vias: 20.6,24.9
N$111  (via drill 0.35)
  other vias: 20.6,24.2
N$112  (via drill 0.35)
  other vias: 19.9,24.2
N$113  (via drill 0.35)
  other vias: 19.9,24.9
N$114  (via drill 0.35)
  other vias: 19.9,25.6
N$115  (via drill 0.35)
  other vias: 28.3,23.5
N$116  (via drill 0.35)
  other vias: 28.3,22.8
N$117  (via drill 0.35)
  other vias: 28.3,22.1
N$118  (via drill 0.35)
  other vias: 27.6,22.1
N$119  (via drill 0.35)
  other vias: 27.6,22.8
N$120  (via drill 0.35)
  other vias: 27.6,23.5
N$121  (via drill 0.35)
  other vias: 28.3,25.6
N$122  (via drill 0.35)
  other vias: 28.3,24.9
N$123  (via drill 0.35)
  other vias: 28.3,24.2
N$124  (via drill 0.35)
  other vias: 27.6,24.2
N$125  (via drill 0.35)
  other vias: 27.6,24.9
N$126  (via drill 0.35)
  other vias: 27.6,25.6
N$127  (via drill 0.35)
  other vias: 29.7,23.5
N$128  (via drill 0.35)
  other vias: 29.7,22.8
N$129  (via drill 0.35)
  other vias: 29.7,22.1
N$130  (via drill 0.35)
  other vias: 29,22.1
N$131  (via drill 0.35)
  other vias: 29,22.8
N$132  (via drill 0.35)
  other vias: 29,23.5
N$133  (via drill 0.35)
  other vias: 29.7,25.6
N$134  (via drill 0.35)
  other vias: 29.7,24.9
N$135  (via drill 0.35)
  other vias: 29.7,24.2
N$136  (via drill 0.35)
  other vias: 29,24.2
N$137  (via drill 0.35)
  other vias: 29,24.9
N$138  (via drill 0.35)
  other vias: 29,25.6
N$139  (via drill 0.35)
  other vias: 29.7,21.4
N$140  (via drill 0.35)
  other vias: 29.7,20.7
N$141  (via drill 0.35)
  other vias: 29.7,20
N$142  (via drill 0.35)
  other vias: 29,20
N$143  (via drill 0.35)
  other vias: 29,20.7
N$144  (via drill 0.35)
  other vias: 29,21.4
N$145  (via drill 0.35)
  other vias: 29.7,19.3
N$146  (via drill 0.35)
  other vias: 29.7,18.6
N$147  (via drill 0.35)
  other vias: 29.7,17.9
N$148  (via drill 0.35)
  other vias: 29,17.9
N$149  (via drill 0.35)
  other vias: 29,18.6
N$150  (via drill 0.35)
  other vias: 29,19.3
N$151  (via drill 0.35)
  other vias: 19.2,23.5
N$152  (via drill 0.35)
  other vias: 19.2,22.8
N$153  (via drill 0.35)
  other vias: 19.2,22.1
N$154  (via drill 0.35)
  other vias: 18.5,22.1
N$155  (via drill 0.35)
  other vias: 18.5,22.8
N$156  (via drill 0.35)
  other vias: 18.5,23.5
N$157  (via drill 0.35)
  other vias: 19.2,21.4
N$158  (via drill 0.35)
  other vias: 19.2,20.7
N$159  (via drill 0.35)
  other vias: 19.2,20
N$160  (via drill 0.35)
  other vias: 18.5,20
N$161  (via drill 0.35)
  other vias: 18.5,20.7
N$162  (via drill 0.35)
  other vias: 18.5,21.4
N$163  (via drill 0.35)
  other vias: 19.2,19.3
N$164  (via drill 0.35)
  other vias: 19.2,18.6
N$165  (via drill 0.35)
  other vias: 19.2,17.9
N$166  (via drill 0.35)
  other vias: 18.5,17.9
N$167  (via drill 0.35)
  other vias: 18.5,18.6
N$168  (via drill 0.35)
  other vias: 18.5,19.3
N$169  (via drill 0.35)
  other vias: 19.2,25.6
N$170  (via drill 0.35)
  other vias: 19.2,24.9
N$171  (via drill 0.35)
  other vias: 19.2,24.2
N$172  (via drill 0.35)
  other vias: 18.5,24.2
N$173  (via drill 0.35)
  other vias: 18.5,24.9
N$174  (via drill 0.35)
  other vias: 18.5,25.6
N$175  (via drill 0.35)
  other vias: 17.8,25.6
N$176  (via drill 0.35)
  other vias: 17.8,24.9
N$177  (via drill 0.35)
  other vias: 17.8,24.2
N$178  (via drill 0.35)
  other vias: 17.1,24.2
N$179  (via drill 0.35)
  other vias: 17.1,24.9
N$180  (via drill 0.35)
  other vias: 17.1,25.6
N$181  (via drill 0.35)
  other vias: 17.8,23.5
N$182  (via drill 0.35)
  other vias: 17.8,22.8
N$183  (via drill 0.35)
  other vias: 17.8,22.1
N$184  (via drill 0.35)
  other vias: 17.1,22.1
N$185  (via drill 0.35)
  other vias: 17.1,22.8
N$186  (via drill 0.35)
  other vias: 17.1,23.5
N$187  (via drill 0.35)
  other vias: 17.8,21.4
N$188  (via drill 0.35)
  other vias: 17.8,20.7
N$189  (via drill 0.35)
  other vias: 17.8,20
N$190  (via drill 0.35)
  other vias: 17.1,20
N$191  (via drill 0.35)
  other vias: 17.1,20.7
N$192  (via drill 0.35)
  other vias: 17.1,21.4
N$193  (via drill 0.35)
  other vias: 17.8,19.3
N$194  (via drill 0.35)
  other vias: 17.8,18.6
N$195  (via drill 0.35)
  other vias: 17.8,17.9
N$196  (via drill 0.35)
  other vias: 17.1,17.9
N$197  (via drill 0.35)
  other vias: 17.1,18.6
N$198  (via drill 0.35)
  other vias: 17.1,19.3
N$199  (via drill 0.35)
  other vias: 31.1,25.6
N$200  (via drill 0.35)
  other vias: 31.1,24.9
N$201  (via drill 0.35)
  other vias: 31.1,24.2
N$202  (via drill 0.35)
  other vias: 30.4,24.2
N$203  (via drill 0.35)
  other vias: 30.4,24.9
N$204  (via drill 0.35)
  other vias: 30.4,25.6
N$205  (via drill 0.35)
  other vias: 31.1,23.5
N$206  (via drill 0.35)
  other vias: 31.1,22.8
N$207  (via drill 0.35)
  other vias: 31.1,22.1
N$208  (via drill 0.35)
  other vias: 30.4,22.1
N$209  (via drill 0.35)
  other vias: 30.4,22.8
N$210  (via drill 0.35)
  other vias: 30.4,23.5
N$211  (via drill 0.35)
  other vias: 31.1,21.4
N$212  (via drill 0.35)
  other vias: 31.1,20.7
N$213  (via drill 0.35)
  other vias: 31.1,20
N$214  (via drill 0.35)
  other vias: 30.4,20
N$215  (via drill 0.35)
  other vias: 30.4,20.7
N$216  (via drill 0.35)
  other vias: 30.4,21.4
N$217  (via drill 0.35)
  other vias: 31.1,19.3
N$218  (via drill 0.35)
  other vias: 31.1,18.6
N$219  (via drill 0.35)
  other vias: 31.1,17.9
N$220  (via drill 0.35)
  other vias: 30.4,17.9
N$221  (via drill 0.35)
  other vias: 30.4,18.6
N$222  (via drill 0.35)
  other vias: 30.4,19.3
N$223  (via drill 0.35)
  other vias: 25.4,25.6
N$224  (via drill 0.35)
  other vias: 25.4,24.9
N$225  (via drill 0.35)
  other vias: 25.4,24.2
NO  (2 unrouted)
PA3  (2 unrouted)
PA4  (2 unrouted)
PA5  (2 unrouted)
PA6  (2 unrouted)
PB0  (2 unrouted)
PB1  (2 unrouted)
PB4  (2 unrouted)
PB5  (2 unrouted)
PD3  (2 unrouted)
PE0  (2 unrouted)
PE1  (2 unrouted)
PE2  (2 unrouted)
PE3  (2 unrouted)
PE4  (2 unrouted)
PE5  (2 unrouted)
PF3  (2 unrouted)
PF4  (2 unrouted)
RPE  (3 unrouted)
RS  (2 unrouted)
RST  (4 unrouted)
RX  (1 unrouted)
RXD  (1 unrouted)
SCL  (4 unrouted)
SDA  (4 unrouted)
SDFSDFSD  (2 unrouted)
SERVO1  (1 unrouted)
SERVO2  (1 unrouted)
SERVO3  (1 unrouted)
SHARP1  (2 unrouted)
SHARP2  (2 unrouted)
SHARP3  (2 unrouted)
SHARP4  (2 unrouted)
SHARP5  (2 unrouted)
TX  (1 unrouted)
TXD  (1 unrouted)
USB+  (2 unrouted)
USB-  (2 unrouted)
VBATTERY  (5 unrouted)
VDD  (26 unrouted)
VDDC  (5 unrouted)
VSERVO  (9 unrouted)
VUSB  (1 unrouted)
WL1  (2 unrouted)
WL2  (2 unrouted)
WL3  (2 unrouted)
WL4  (2 unrouted)
WL5  (2 unrouted)
WL6  (2 unrouted)
WL7  (2 unrouted)
XXVX  (2 unrouted)
ZIGBEERX  (2 unrouted)
ZIGBEETX  (2 unrouted)

### Text on the board
tNames: 0 | 1 | 2 | 3 | 4 | 5 | 6 | 7 | 7 | 6 | 5 | 4 | 3 | 2 | 0 | 1